# Altium schematic sheet Functional Schematic 1m mirror cell controller.SchDoc
size B; PageSetup: Record=PageOptions|CenterHorizontal=True|CenterVertical=True|PrintScale=1.12|XCorrection=1.00|YCorrection=1.00|PrintKind=0|BorderSize=5000000|LeftOffset=0|BottomOffset=0|Orientation=2|PaperLength=1000|PaperWidth=1000|Scale=100|PaperSource=7|PrintQuality=-4|MediaType=1|DitherType=10|PaperKind=Tabloid|PrintScaleMode=1
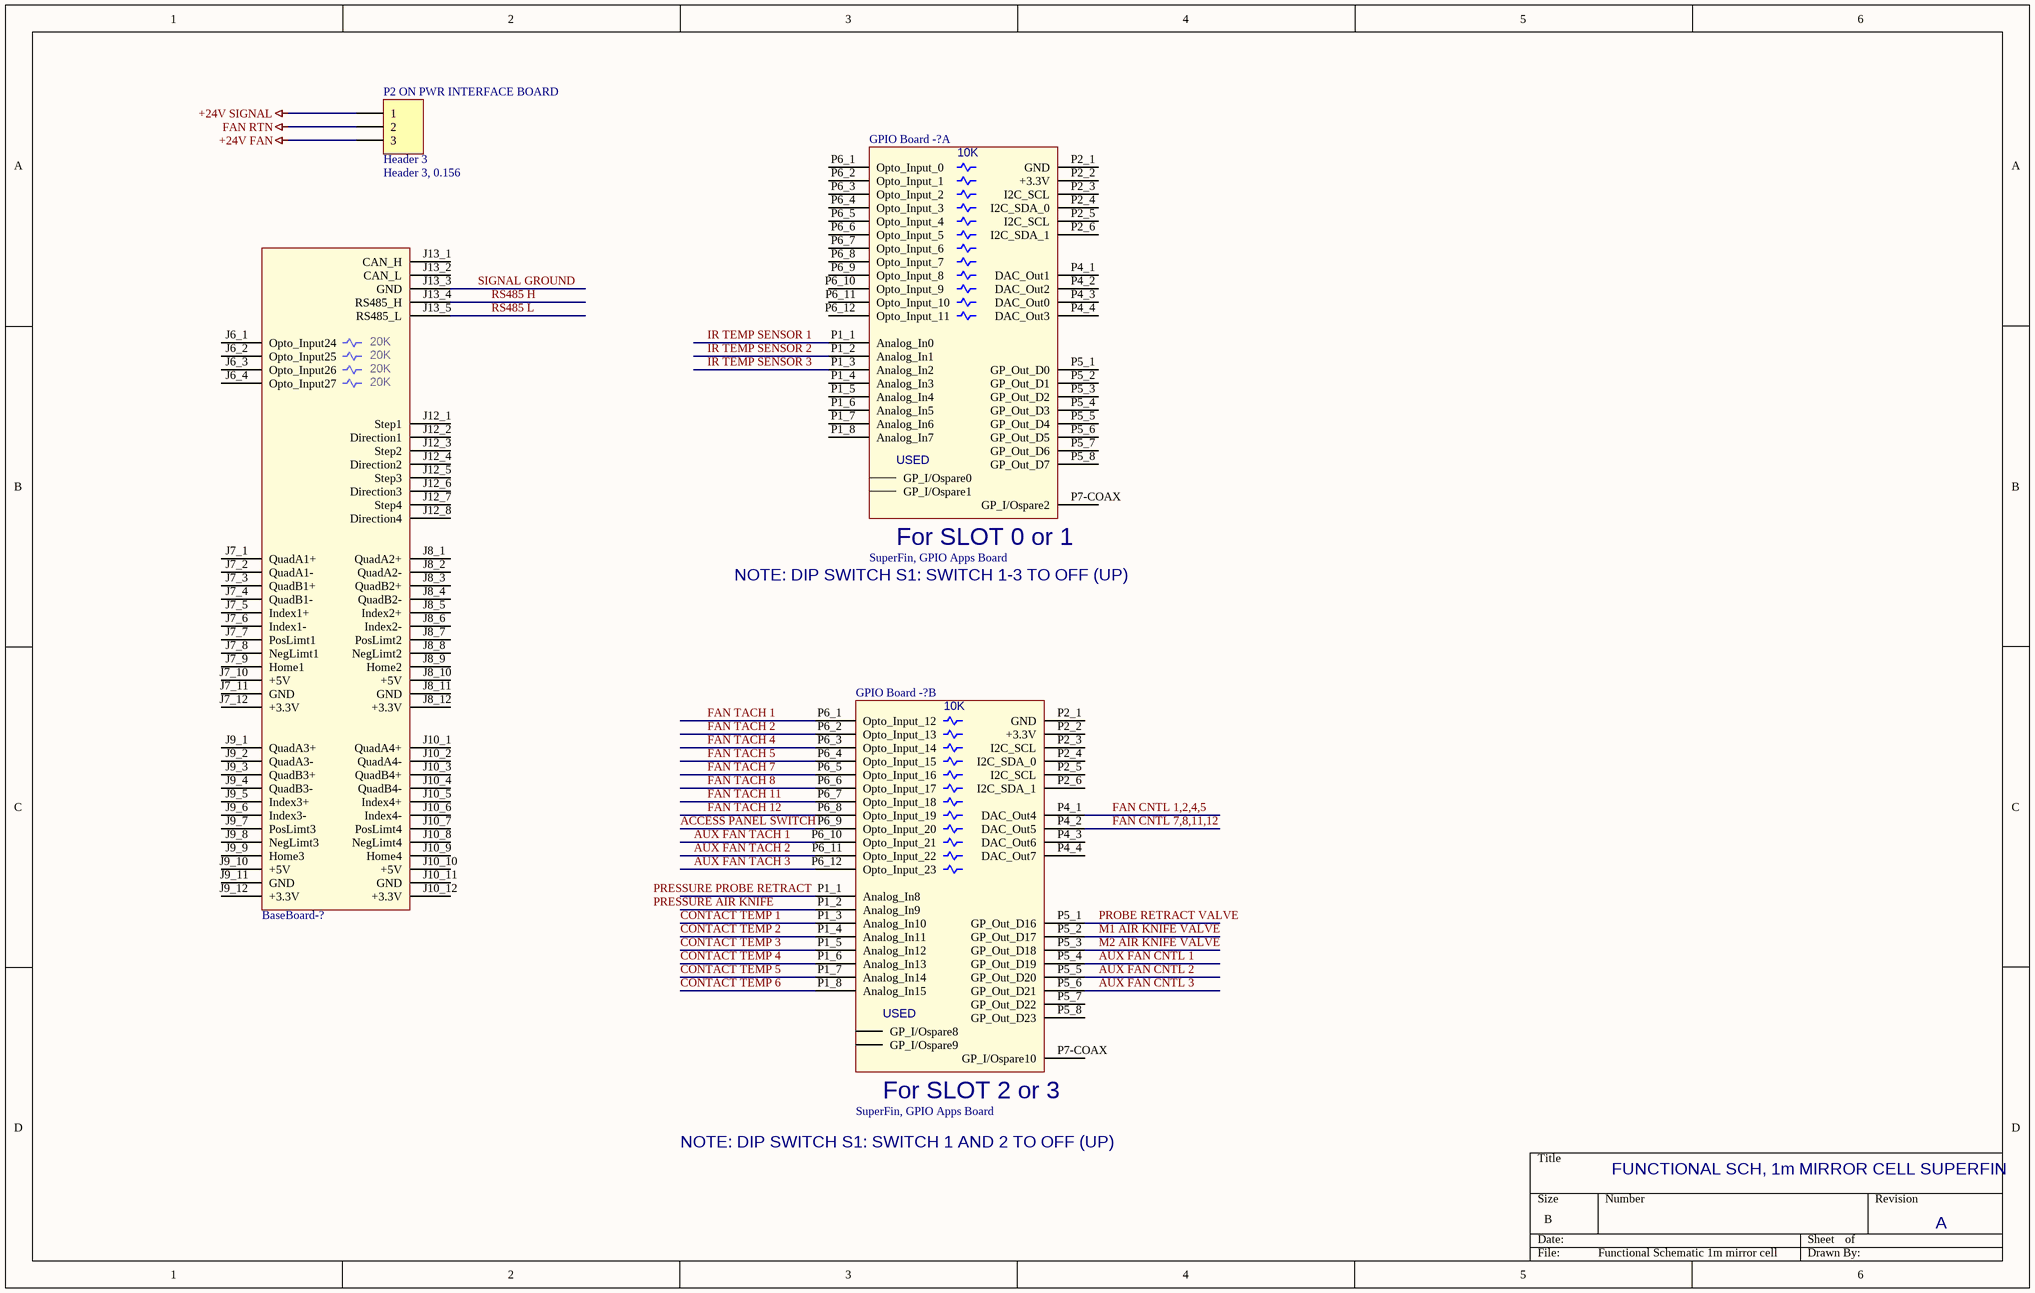
[diagram p0: Functional Schematic 1m mirror cell controller.SchDoc]

## Parts
(Parts that share a designator on the sheet are numbered #1, #2 ... from top to bottom, then left to right.)
BaseBoard-?  SuperFin BaseBoard  (value not drawn)
GPIO_Board_-?#1  SuperFin, GPIO Apps Board  (part A of 2)
GPIO_Board_-?#2  SuperFin, GPIO Apps Board  (part B of 2)
P2_ON_PWR_INTERFACE_BOARD  Header 3  value Header 3, 0.156  [HDR 1X3 0.156"]

## Nets
+24V FAN: P2_ON_PWR_INTERFACE_BOARD.3
+24V SIGNAL: P2_ON_PWR_INTERFACE_BOARD.1
FAN RTN: P2_ON_PWR_INTERFACE_BOARD.2
ACCESS PANEL SWITCH: GPIO_Board_-?#2.P6_9(Opto_Input_20)
AUX FAN CNTL 1: GPIO_Board_-?#2.P5_4(GP_Out_D19)
AUX FAN CNTL 2: GPIO_Board_-?#2.P5_5(GP_Out_D20)
AUX FAN CNTL 3: GPIO_Board_-?#2.P5_6(GP_Out_D21)
AUX FAN TACH 1: GPIO_Board_-?#2.P6_10(Opto_Input_21)
AUX FAN TACH 2: GPIO_Board_-?#2.P6_11(Opto_Input_22)
AUX FAN TACH 3: GPIO_Board_-?#2.P6_12(Opto_Input_23)
CONTACT TEMP 1: GPIO_Board_-?#2.P1_3(Analog_In10)
CONTACT TEMP 2: GPIO_Board_-?#2.P1_4(Analog_In11)
CONTACT TEMP 3: GPIO_Board_-?#2.P1_5(Analog_In12)
CONTACT TEMP 4: GPIO_Board_-?#2.P1_6(Analog_In13)
CONTACT TEMP 5: GPIO_Board_-?#2.P1_7(Analog_In14)
CONTACT TEMP 6: GPIO_Board_-?#2.P1_8(Analog_In15)
FAN CNTL 1,2,4,5: GPIO_Board_-?#2.P4_1(DAC_Out4)
FAN CNTL 7,8,11,12: GPIO_Board_-?#2.P4_2(DAC_Out5)
FAN TACH 1: GPIO_Board_-?#2.P6_1(Opto_Input_12)
FAN TACH 2: GPIO_Board_-?#2.P6_2(Opto_Input_13)
FAN TACH 4: GPIO_Board_-?#2.P6_3(Opto_Input_14)
FAN TACH 5: GPIO_Board_-?#2.P6_4(Opto_Input_15)
FAN TACH 7: GPIO_Board_-?#2.P6_5(Opto_Input_16)
FAN TACH 8: GPIO_Board_-?#2.P6_6(Opto_Input_17)
FAN TACH 11: GPIO_Board_-?#2.P6_7(Opto_Input_18)
FAN TACH 12: GPIO_Board_-?#2.P6_8(Opto_Input_19)
IR TEMP SENSOR 1: GPIO_Board_-?#1.P1_1(Analog_In0)
IR TEMP SENSOR 2: GPIO_Board_-?#1.P1_2(Analog_In1)
IR TEMP SENSOR 3: GPIO_Board_-?#1.P1_3(Analog_In2)
M1 AIR KNIFE VALVE: GPIO_Board_-?#2.P5_2(GP_Out_D17)
M2 AIR KNIFE VALVE: GPIO_Board_-?#2.P5_3(GP_Out_D18)
PROBE RETRACT VALVE: GPIO_Board_-?#2.P5_1(GP_Out_D16)
RS485 H: BaseBoard-?.J13_4(RS485_H)
RS485 L: BaseBoard-?.J13_5(RS485_L)
SIGNAL GROUND: BaseBoard-?.J13_3(GND)

Not connected (* = marked no-connect by the designer): BaseBoard-? J6_1(Opto_Input24) J6_2(Opto_Input25) J6_3(Opto_Input26) J6_4(Opto_Input27) J7_1(QuadA1+) J7_2(QuadA1-) J7_3(QuadB1+) J7_4(QuadB1-) J7_5(Index1+) J7_6(Index1-) J7_7(PosLimt1) J7_8(NegLimt1) J7_9(Home1) J7_10(+5V) J7_11(GND) J7_12(+3.3V) J8_1(QuadA2+) J8_2(QuadA2-) J8_3(QuadB2+) J8_4(QuadB2-) J8_5(Index2+) J8_6(Index2-) J8_7(PosLimt2) J8_8(NegLimt2) J8_9(Home2) J8_10(+5V) J8_11(GND) J8_12(+3.3V) J9_1(QuadA3+) J9_2(QuadA3-) J9_3(QuadB3+) J9_4(QuadB3-) J9_5(Index3+) J9_6(Index3-) J9_7(PosLimt3) J9_8(NegLimt3) J9_9(Home3) J9_10(+5V) J9_11(GND) J9_12(+3.3V) J10_1(QuadA4+) J10_2(QuadA4-) J10_3(QuadB4+) J10_4(QuadB4-) J10_5(Index4+) J10_6(Index4-) J10_7(PosLimt4) J10_8(NegLimt4) J10_9(Home4) J10_10(+5V) J10_11(GND) J10_12(+3.3V) J12_1(Step1) J12_2(Direction1) J12_3(Step2) J12_4(Direction2) J12_5(Step3) J12_6(Direction3) J12_7(Step4) J12_8(Direction4) J13_1(CAN_H) J13_2(CAN_L); GPIO_Board_-?#1 0(GP_I/Ospare1) P1_4(Analog_In3) P1_5(Analog_In4) P1_6(Analog_In5) P1_7(Analog_In6) P1_8(Analog_In7) P2_1(GND) P2_2(+3.3V) P2_3(I2C_SCL) P2_4(I2C_SDA_0) P2_5(I2C_SCL) P2_6(I2C_SDA_1) P4_1(DAC_Out1) P4_2(DAC_Out2) P4_3(DAC_Out0) P4_4(DAC_Out3) P5_1(GP_Out_D0) P5_2(GP_Out_D1) P5_3(GP_Out_D2) P5_4(GP_Out_D3) P5_5(GP_Out_D4) P5_6(GP_Out_D5) P5_7(GP_Out_D6) P5_8(GP_Out_D7) P6_1(Opto_Input_0) P6_2(Opto_Input_1) P6_3(Opto_Input_2) P6_4(Opto_Input_3) P6_5(Opto_Input_4) P6_6(Opto_Input_5) P6_7(Opto_Input_6) P6_8(Opto_Input_7) P6_9(Opto_Input_8) P6_10(Opto_Input_9) P6_11(Opto_Input_10) P6_12(Opto_Input_11) P7-COAX(GP_I/Ospare2); GPIO_Board_-?#2 0(GP_I/Ospare9) P1_1(Analog_In8) P1_2(Analog_In9) P2_1(GND) P2_2(+3.3V) P2_3(I2C_SCL) P2_4(I2C_SDA_0) P2_5(I2C_SCL) P2_6(I2C_SDA_1) P4_3(DAC_Out6) P4_4(DAC_Out7) P5_7(GP_Out_D22) P5_8(GP_Out_D23) P7-COAX(GP_I/Ospare10)

## Notes on the sheet
- NOTE: DIP SWITCH S1: SWITCH 1-3 TO OFF (UP)
- NOTE: DIP SWITCH S1: SWITCH 1 AND 2 TO OFF (UP)
- FUNCTIONAL SCH, 1m MIRROR CELL SUPERFIN
- A
- Labels drawn without touching a wire or pin: PRESSURE AIR KNIFE, PRESSURE PROBE RETRACT
- (in symbol SuperFin BaseBoard) 20K
- (in symbol SuperFin, GPIO Apps Board, part A) 10K; USED; For SLOT 0 or 1
- (in symbol SuperFin, GPIO Apps Board, part B) 10K; USED; For SLOT 2 or 3

## Library data of the parts
P2_ON_PWR_INTERFACE_BOARD = Header 3, 0.156: Header, 3-Pin, 0.156; LCO p/n: 125-00083